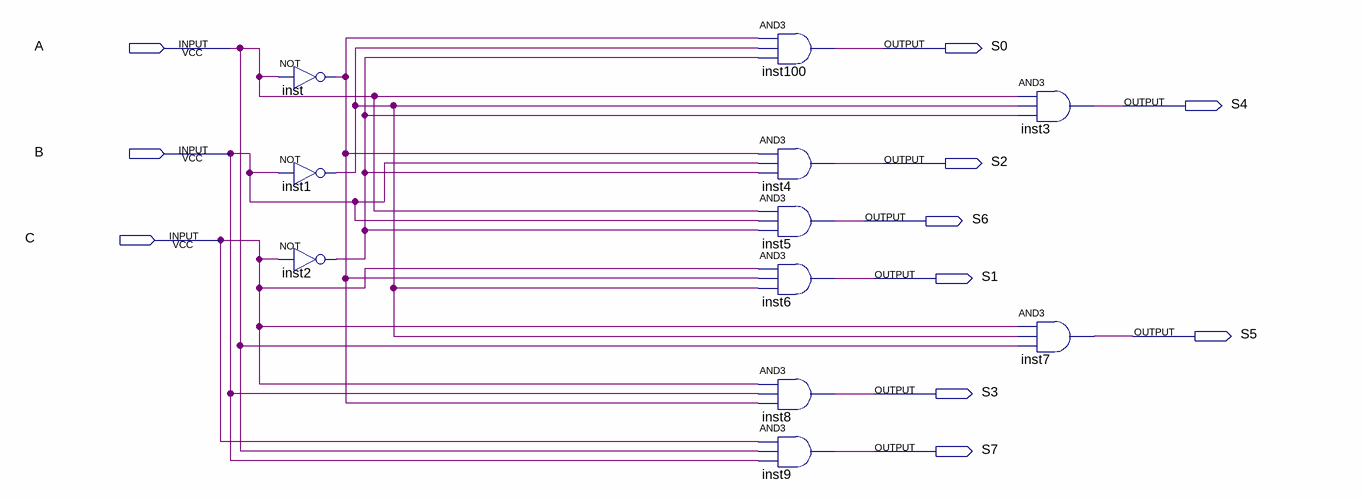
[diagram p0: schematic sheet]
// Quartus schematic Decoder3_8.bdf as structural Verilog: 11 symbols, 11 pins
module Decoder3_8 (
  input  A,
  input  B,
  input  C,
  output S0,
  output S4,
  output S2,
  output S6,
  output S1,
  output S5,
  output S3,
  output S7
);

  wire inst1_out, inst2_out, inst_out;

  not inst (inst_out, A);
  not inst1 (inst1_out, B);
  not inst2 (inst2_out, C);
  and inst100 (S0, inst_out, inst1_out, inst2_out);
  and inst4 (S2, inst_out, B, inst2_out);
  and inst5 (S6, A, B, inst2_out);
  and inst6 (S1, C, inst_out, inst1_out);
  and inst8 (S3, C, B, inst_out);
  and inst9 (S7, C, A, B);
  and inst3 (S4, A, inst1_out, inst2_out);
  and inst7 (S5, C, inst1_out, A);
endmodule
